# Altium schematic sheet POWER_INPUT_STAGE.SchDoc
size 297 x 209 mm; SheetNumber: 2; SheetTotal: 3; SPICEModelCacheWNYSDJRL: <root> / <DocumentId>WNYSDJRL</DocumentId> / </root>
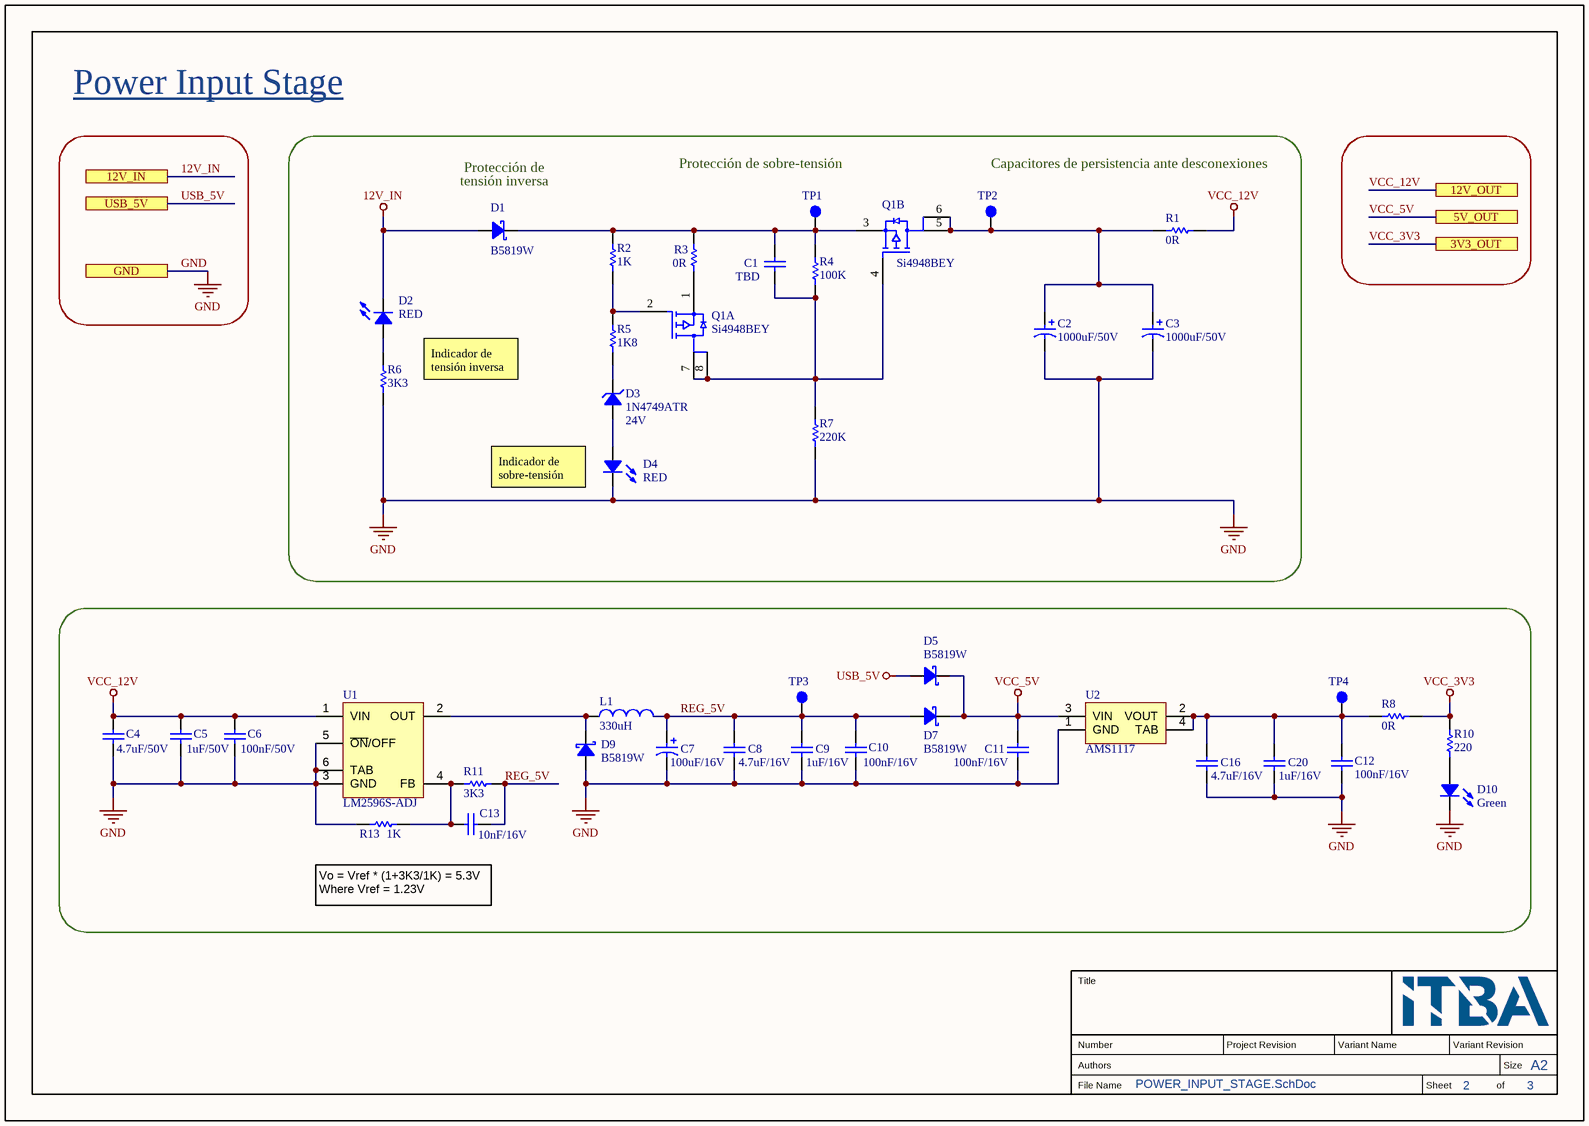
[diagram p0: POWER_INPUT_STAGE.SchDoc]

## Parts
C1  TBD  [CAP0805]
C2  1000uF/50V  [RAD-CAP-12.5/5mm]
C3  1000uF/50V  [RAD-CAP-12.5/5mm]
C4  4.7uF/50V  [CAP0805]
C5  1uF/50V  [CAP0805]
C6  100nF/50V  [CAP0805]
C7  100uF/16V  [RAD-CAP-12.5/5mm]
C8  4.7uF/16V  [CAP0805]
C9  1uF/16V  [CAP0805]
C10  100nF/16V  [CAP0805]
C11  100nF/16V  [CAP0805]
C12  100nF/16V  [CAP0805]
C13  10nF/16V  [CAP0805]
C16  4.7uF/16V  [CAP0805]
C20  1uF/16V  [CAP0805]
D1  B5819W  [SOD-123]
D2  RED  [LED-3MM-RED-RA]
D3  1N4749ATR  Voltage: 24V  [DO-35]
D4  RED  [LED-3MM-RED-RA]
D5  B5819W  [SOD-123]
D7  B5819W  [SOD-123]
D9  B5819W  [SOD-123]
D10  Green  [LED-3MM-GREEN-RA]
L1  330uH  [DRQ127-INDUCTOR]
Q1  Si4948BEY  [8-SOIC]  (parts A,B of 2)
R1  0R  [RES0805]
R2  1K  [RES0805]
R3  0R  [RES0805]
R4  100K  [RES0805]
R5  1K8  [RES0805]
R6  3K3  [RES0805]
R7  220K  [RES0805]
R8  0R  [RES0805]
R10  220  [RES0805]
R11  3K3  [RES0805]
R13  1K  [RES0805]
TP1  Testpoint  [TP_SMD_Ø1.0mm]  (value not drawn)  (no BOM)
TP2  Testpoint  [TP_SMD_Ø1.0mm]  (value not drawn)  (no BOM)
TP3  Testpoint  [TP_SMD_Ø1.0mm]  (value not drawn)  (no BOM)
TP4  Testpoint  [TP_SMD_Ø1.0mm]  (value not drawn)  (no BOM)
U1  LM2596S-ADJ  [LM2596S-ADJ/NOPB]
U2  AMS1117  [SOT223]

## Ports
3V3_OUT, 5V_OUT, 12V_IN, 12V_OUT, GND, USB_5V

## Nets
12V_IN: D1.1(A) D2.2(K) ; port 12V_IN
GND: C2.1 C3.1 C4.1 C5.1 C6.1 C7.1 C8.1 C9.1 C10.1 C11.1 C12.1 C16.1 C20.1 D4.2(K) D9.1(A) D10.2(K) R6.1 R7.1 R13.2 U1.3(GND) U1.5(~{ON}/OFF) U1.6(TAB) U2.1(GND) ; port GND
USB_5V: D5.1(A) ; port USB_5V
VCC_3V3: R8.2 R10.1 ; port 3V3_OUT
VCC_5V: C11.2 D5.2(K) D7.2(K) U2.3(VIN) ; port 5V_OUT
VCC_12V: C4.2 C5.2 C6.2 R1.2 U1.1(VIN) ; port 12V_OUT
REG_5V: C7.2 C8.2 C9.2 C10.2 C13.2 D7.1(A) L1.2 R11.1 TP3.1(TP)
NetC1_1: C1.1 Q1.4(G2) Q1.7(D1) Q1.8(D1) R4.1 R7.2
NetC1_2: C1.2 D1.2(K) Q1.3(S2) R2.2 R3.2 R4.2 TP1.1(TP)
NetC2_2: C2.2 C3.2 Q1.5(D2) Q1.6(D2) R1.1 TP2.1(TP)
NetC12_2: C12.2 C16.2 C20.2 R8.1 TP4.1(TP) U2.2(VOUT) U2.4(TAB)
NetC13_1: C13.1 R11.2 R13.1 U1.4(FB)
NetD2_1: D2.1(A) R6.2
NetD3_1: D3.1(K) R5.1
NetD3_2: D3.2(A) D4.1(A)
NetD9_2: D9.2(K) L1.1 U1.2(OUT)
NetD10_1: D10.1(A) R10.2
NetQ1_1: Q1.1(S1) R3.1
NetQ1_2: Q1.2(G1) R2.1 R5.2

## Notes on the sheet
- Power Input Stage
- Protección de
- (near D1) tensión inversa
- Protección de sobre-tensión
- Capacitores de persistencia ante desconexiones
- Indicador de tensión inversa
- (near D4) Indicador de sobre-tensión
- Vo = Vref * (1+3K3/1K) = 5.3V
  Where Vref = 1.23V
- Title
- File Name
- Number
- Authors
- Project Revision
- Variant Name
- Sheet
- Variant Revision
- of
- Size
- A2

## Library data of the parts
C1 C4-C6 C8-C13 C16 C20 = Capacitor: SMD 0805 Capacitor
C2 C3 C7 = Capacitor Polarized: Polarized Capacitor (Radial)
D1 D5 D7 D9 = Diode Schottky: Schottky Diode
D2 D4 = LED 3mm Red RA: Red 3mm LED
D3 = Diode Zener: Zener Diode
D10 = LED 3mm Green RA: Green 3mm LED
L1 = Inductor: Code_IEC: 1005; Published: 8-Jun-2000; LatestRevisionDate: 29-May-2009; LatestRevisionNote: IPC-7351 Footprint Added.; PackageReference: 0402-A; Publisher: Altium Limited; PackageDescription: Chip Inductor; Code_JEITA: 0402
Q1 = Si4948BEY: MOSFET 2P-CH 60V 2.4A 8-SOIC; Number of Elements: 2; Rise Time: 15ns; Turn-On Delay Time: 10ns; Turn-Off Delay Time: 50ns; Rds On Max: 120mR; Nominal Vgs: -3V; Polarity: P-CHANNEL; Max Power Dissipation: 1.4W; Element Configuration: Dual; Gate to Source Voltage (Vgs): 20V; Drain to Source Voltage (Vdss): -60V; Weight: 0.006596oz; Number of Pins: 8; Height: 1.55mm; Drain to Source Resistance: 120mR; Continuous Drain Current (ID): 2.4A; Packaging: Tape and Reel; On-State Resistance: 120mR; Fall Time: 15ns; Max Operating Temperature: 175°C; Drain-source On Resistance-Max: 120mR; Series: TrenchFET®; Radiation Hardening: No; Threshold Voltage: -3V; Lead Free: Lead Free; RoHS Compliant: Yes; Package Quantity: 2500; Power Dissipation: 1.4W; Min Operating Temperature: -55°C; Number of Channels: 2; Case/Package: SO; Reach SVHC Compliant: Yes; Width: 4mm; Length: 5mm; Mount: Surface Mount
R1-R8 R10 R11 R13 = Resistor: SMD 0805 Resistor
U1 = LM2596S-ADJ/NOPB: SIMPLE SWITCHER® Power Converter 150 KHz 3A Step-Down Voltage Regulator, 5-pin TO-263, Pb-Free
U2 = AMS1117: 1A LOW DROPOUT VOLTAGE REGULATOR